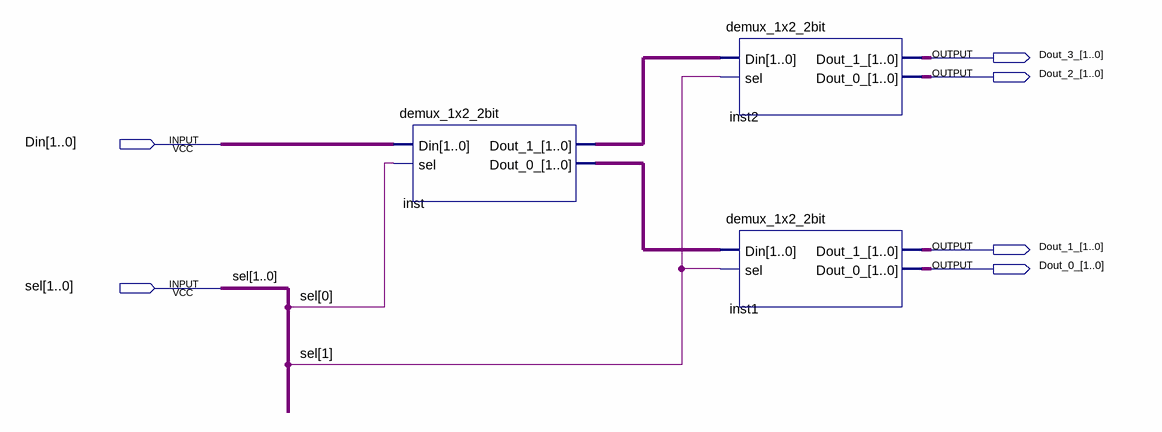
[diagram p0: schematic sheet]
// Quartus schematic demux_1x4_2bit.bdf as structural Verilog: 3 symbols, 6 pins
module demux_1x4_2bit (
  input  [1:0] Din,
  input  [1:0] sel,
  output [1:0] Dout_3_,
  output [1:0] Dout_2_,
  output [1:0] Dout_1_,
  output [1:0] Dout_0_
);

  wire [1:0] inst_dout_0_, inst_dout_1_;

  demux_1x2_2bit inst (.Din(Din), .sel(sel[0]), .Dout_1_(inst_dout_1_), .Dout_0_(inst_dout_0_));
  demux_1x2_2bit inst2 (.Din(inst_dout_1_), .sel(sel[1]), .Dout_1_(Dout_3_), .Dout_0_(Dout_2_));
  demux_1x2_2bit inst1 (.Din(inst_dout_0_), .sel(sel[1]), .Dout_1_(Dout_1_), .Dout_0_(Dout_0_));
endmodule
